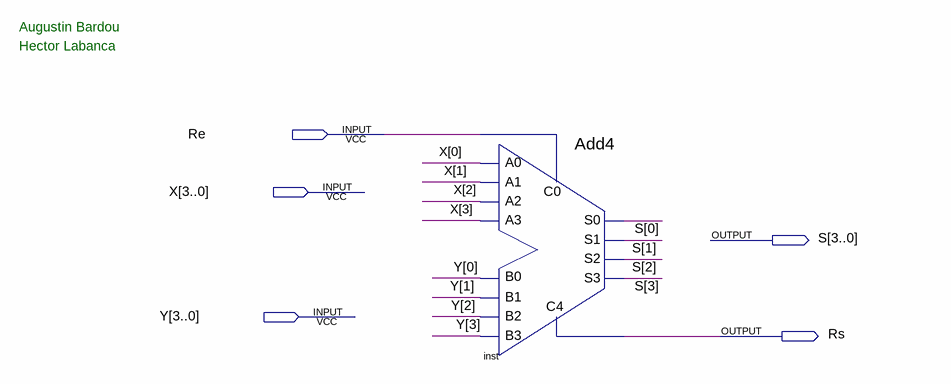
[diagram p0: schematic sheet]
// Quartus schematic add4group.bdf as structural Verilog: 1 symbols, 5 pins
module add4group (
  input  Re,
  input  [3:0] X,
  input  [3:0] Y,
  output [3:0] S,
  output Rs
);

  Add4 inst (
    .C0(Re), .A3(X[3]), .A2(X[2]), .A1(X[1]), .A0(X[0]), .B3(Y[3]), .B2(Y[2]), .B1(Y[1]), .B0(Y[0]), .C4(Rs),
    .S3(S[3]), .S2(S[2]), .S1(S[1]), .S0(S[0]));

  // Notes on the sheet:
  //   Augustin Bardou
  //   Hector Labanca
endmodule
